# Altium schematic sheet SEQUENCER.SchDoc
size A3
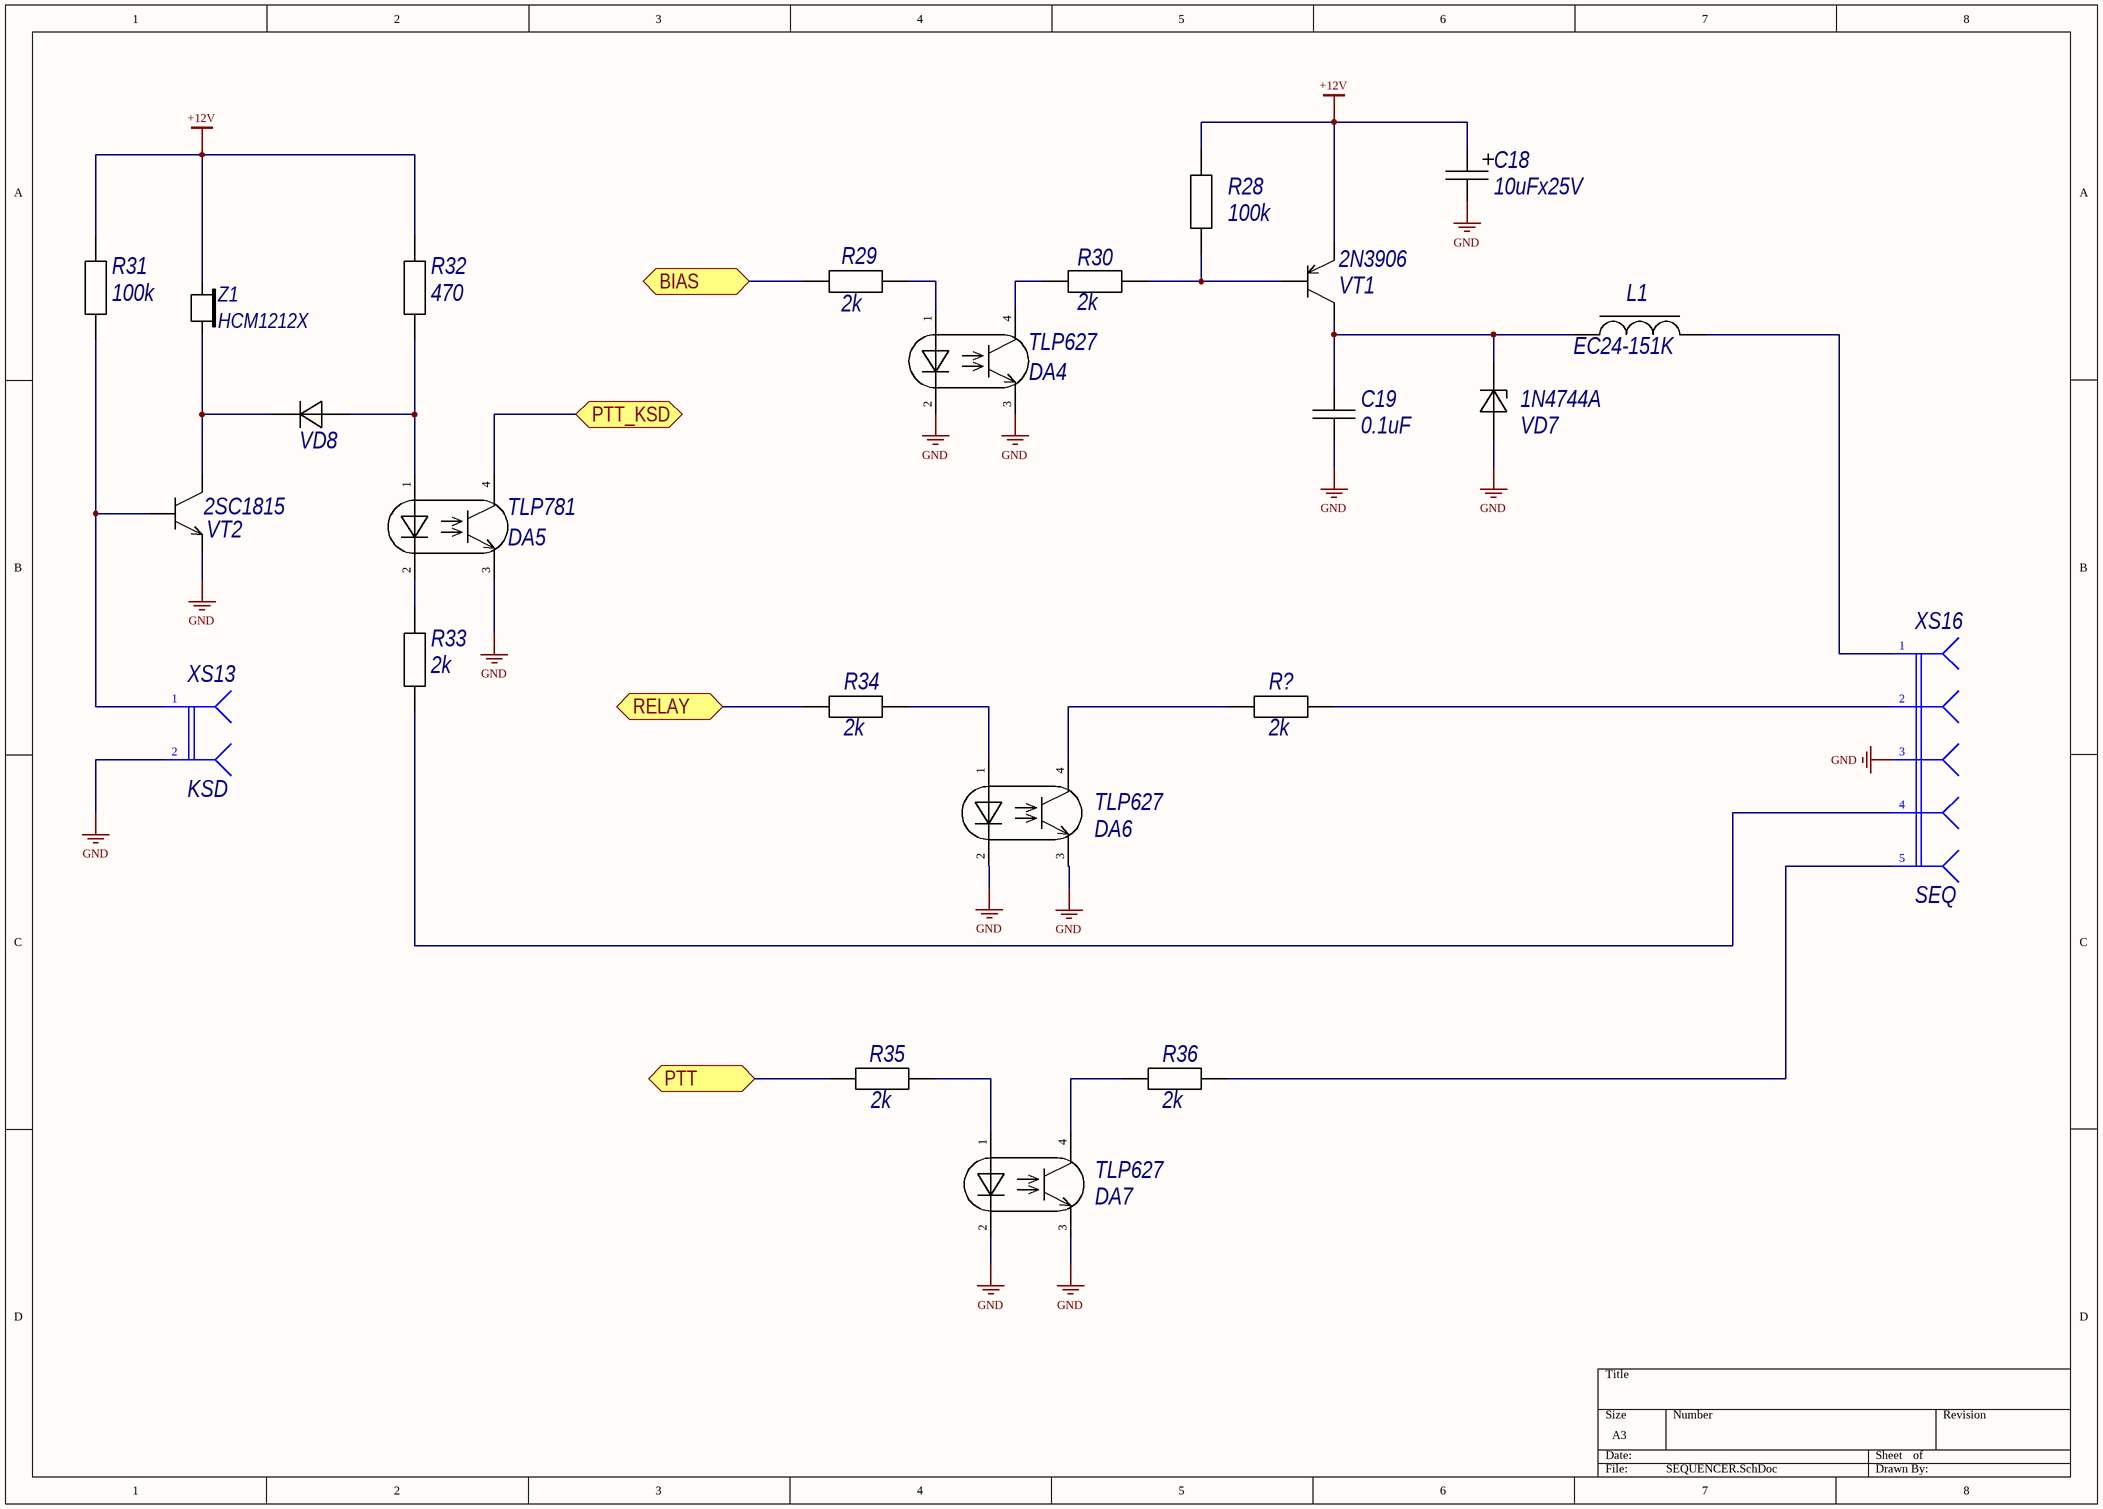
[diagram p0: SEQUENCER.SchDoc]

## Parts
C18  10uFx25V  [TECAP_A]
C19  0.1uF  [C0805C]
DA4  TLP627  [DIP-4]
DA5  TLP781  [DIP-4]
DA6  TLP627  [DIP-4]
DA7  TLP627  [DIP-4]
L1  EC24-151K  [AXIAL-0.6]
R28  100k  [AXIAL-0.6]
R29  2k  [AXIAL-0.6]
R30  2k  [AXIAL-0.6]
R31  100k  [AXIAL-0.6]
R32  470  [AXIAL-0.6]
R33  2k  [AXIAL-0.6]
R34  2k  [AXIAL-0.6]
R35  2k  [AXIAL-0.6]
R36  2k  [AXIAL-0.6]
R?  2k  [AXIAL-0.6]
VD7  1N4744A  [DO-41]
VD8  1N4007  [DO-41]  (value not drawn)
VT1  2N3906  [TO-92-A]
VT2  2SC1815  [TO-92-A]
XS13  KSD  [WF-2]
XS16  SEQ  [WF-5]
Z1  HCM1212X  [HCM1206X]

## Ports
BIAS (bidir), PTT (bidir), PTT_KSD (bidir), RELAY (bidir)

## Nets
+12V: C18.1 R28.1 R31.2 R32.2 VT1.3(Э) Z1.2
GND: C18.2 C19.2 DA4.2(CК) DA4.3(Э) DA5.3(Э) DA6.2(CК) DA6.3(Э) DA7.2(CК) DA7.3(Э) VD7.1(А) VT2.3(Э) XS13.2 XS16.3
BIAS: R29.2 ; port BIAS
PTT: R35.2 ; port PTT
PTT_KSD: DA5.4(К) ; port PTT_KSD
RELAY: R34.2 ; port RELAY
NetC19_1: C19.1 L1.1 VD7.2(К) VT1.2(К)
NetDA4_1: DA4.1(CА) R29.1
NetDA4_4: DA4.4(К) R30.2
NetDA5_1: DA5.1(CА) R32.1 VD8.2
NetDA5_2: DA5.2(CК) R33.2
NetDA6_1: DA6.1(CА) R34.1
NetDA6_4: DA6.4(К) R?.2
NetDA7_1: DA7.1(CА) R35.1
NetDA7_4: DA7.4(К) R36.2
NetL1_2: L1.2 XS16.1
NetR28_2: R28.2 R30.1 VT1.1(Б)
NetR31_1: R31.1 VT2.1(Б) XS13.1
NetR33_1: R33.1 XS16.4
NetR36_1: R36.1 XS16.5
NetR?_1: R?.1 XS16.2
NetVD8_1: VD8.1 VT2.2(К) Z1.1

## Library data of the parts
C18 = CAP_TECAP_A: Type: Конденсатор; Published: 20.08.2010; Publisher: Andrew Danich
C19 = CAP_0805: Type: Конденсатор; Published: 18.05.2010; Publisher: Andrew Danich
L1 = IND_BIAS: Type: Дроссель; Published: 20.05.2010; Publisher: Andrew Danich
R28-R36 R? = RES_1W: Published: 24.03.2010; Publisher: Andrew Danich; Type: Резистор
VD7 = 1N4744A: Type: Стабилитрон; Published: 20.05.2013; Publisher: Andrew Danich
VD8 = 1N4007: Type: Диод; Published: 18.05.2010; Publisher: Andrew Danich
VT1 = 2N3906: Type: Транзистор; Published: 07.05.2013; Publisher: Andrew Danich
VT2 = 2SC1815: Type: Транзистор; Published: 07.05.2013; Publisher: Andrew Danich
XS13 = CONNECT_KSD: Value: Connector; Published: 07.03.2013; Publisher: Andrew Danich; Type: Розетка
XS16 = CONNECT_SEQ: Value: Connector; Published: 07.03.2013; Publisher: Andrew Danich; Type: Розетка
DA4 DA6 DA7 = TLP627: Published: 09.01.2017; Publisher: Andrew Danich; Type: Микросхема
DA5 = TLP781: Published: 09.01.2017; Publisher: Andrew Danich; Type: Микросхема